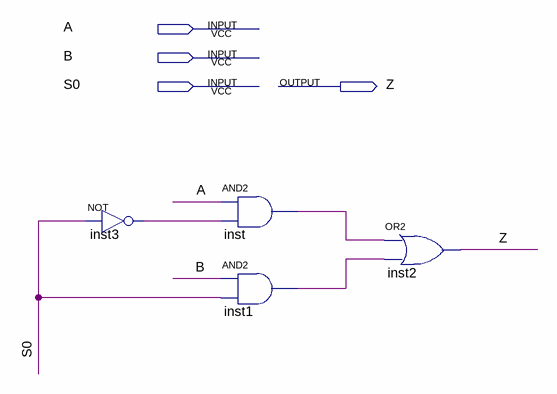
[diagram p0: schematic sheet]
// Quartus schematic mux21_1b.bdf as structural Verilog: 4 symbols, 4 pins
module mux21_1b (
  input  A,
  input  B,
  input  S0,
  output Z
);

  wire inst1_out, inst3_out, inst_out;

  not inst3 (inst3_out, S0);
  and inst (inst_out, A, inst3_out);
  and inst1 (inst1_out, B, S0);
  or inst2 (Z, inst_out, inst1_out);
endmodule
